# Altium schematic sheet TopSheet.SchDoc
size A4; CompanyName: Technische Hochschule Nürnberg Georg Simon Ohm; Organization: UltraZohm; Address1: Kesslerplatz 12; Address2: 90489 Nürnberg; Address3: GERMANY; DocumentNumber: 1; SheetNumber: 1; SheetTotal: 2; Website: www.ultrazohm.com
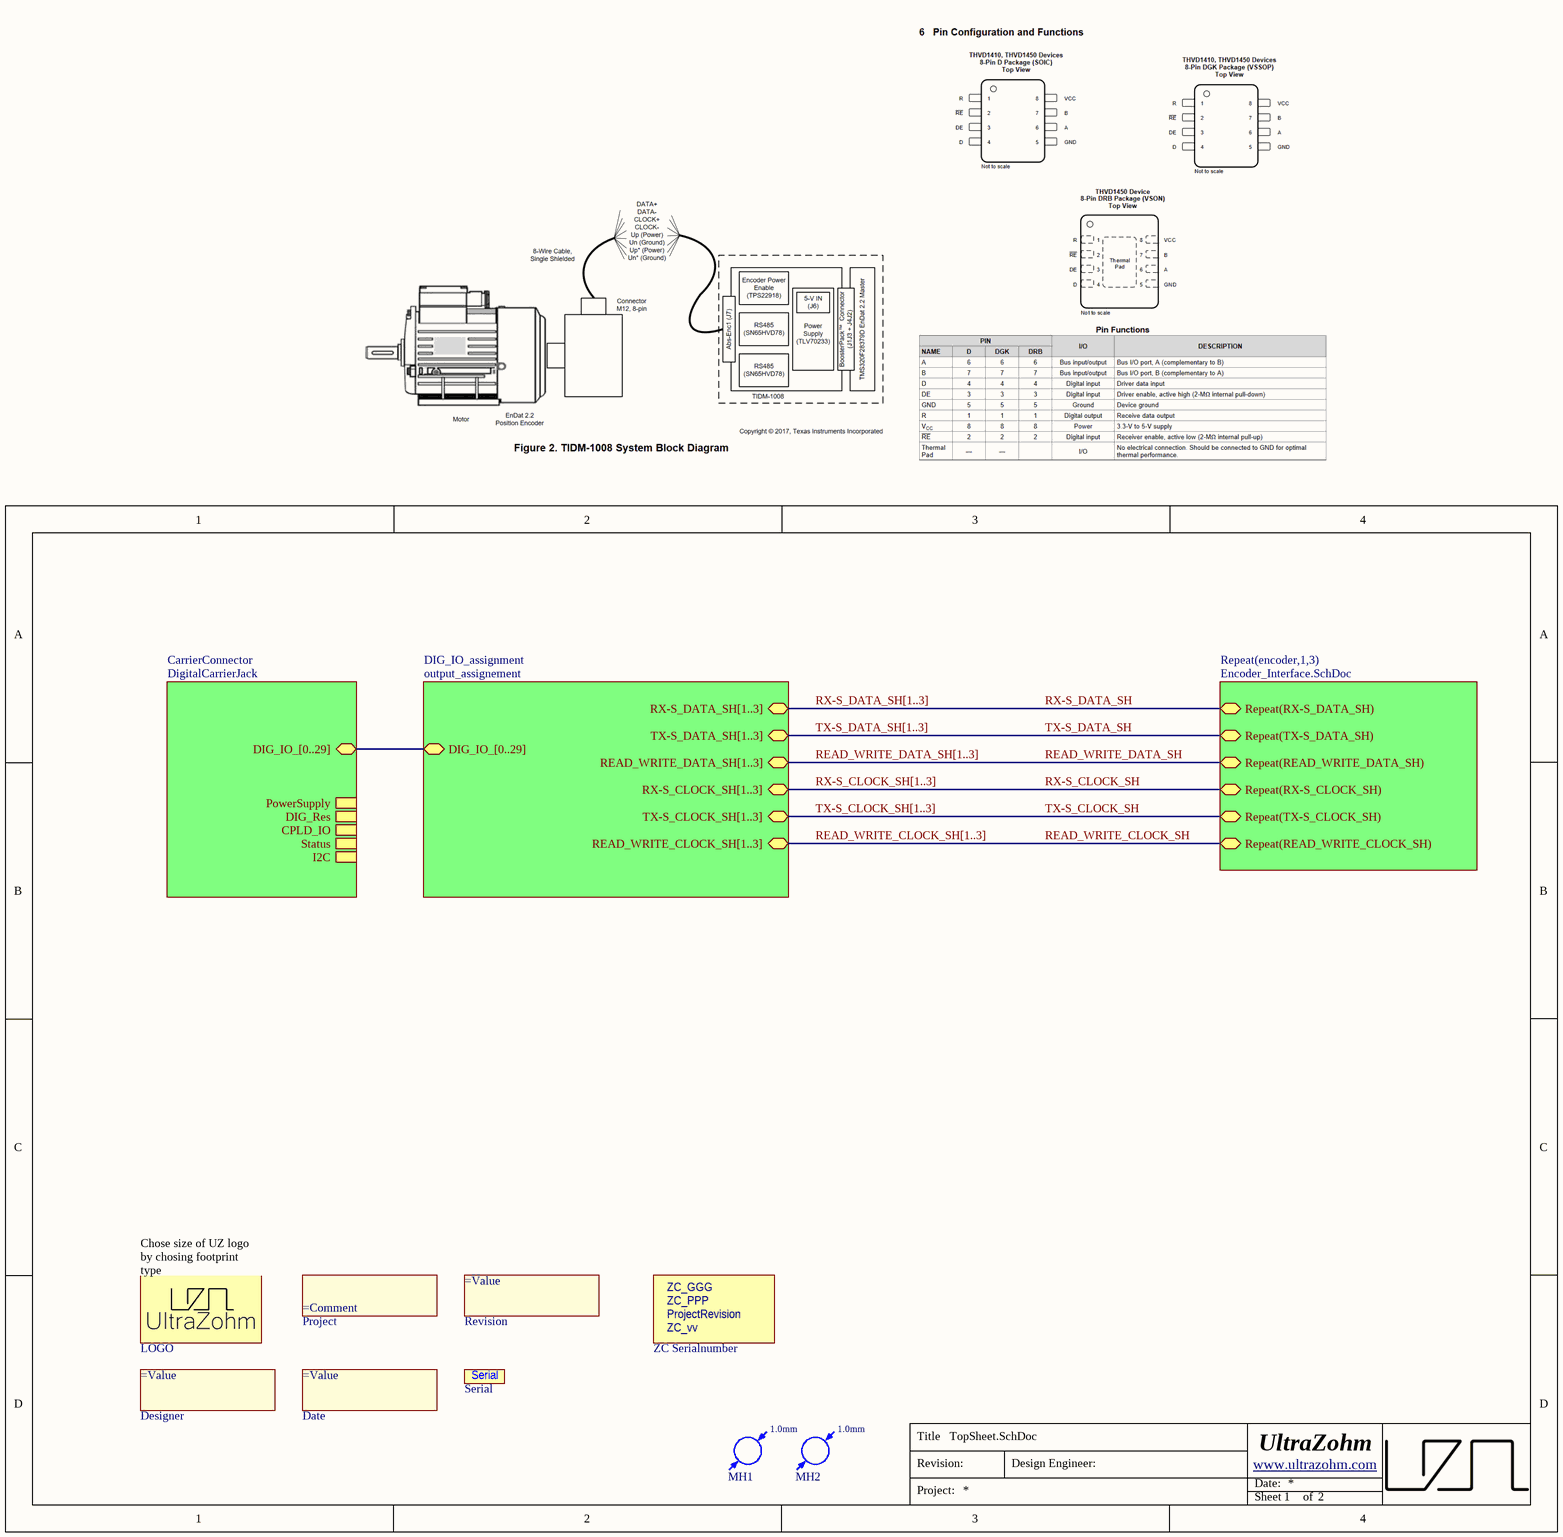
[diagram p0: TopSheet.SchDoc]

## Parts
Date  (no value)  [COMMENT]  (no BOM)
Designer  (no value)  [Designator:comment]  (no BOM)
INFO  ZC Serialnumber  [ZC-Serial]  (no BOM)
LOGO  UZ Logo  [UZ_Logo_small]  (value not drawn)  (no BOM)
MH1  alignment hole 1mm  [MH_1]  (value not drawn)  (no BOM)
MH2  alignment hole 1mm  [MH_1]  (value not drawn)  (no BOM)
Project  (no value)  [COMMENT]  (no BOM)
Revision  (no value)  [Designator:comment]  (no BOM)
Serial  Serial #  [SERIAL]  (value not drawn)  (no BOM)

## Sub-sheets
CarrierConnector = DigitalCarrierJack: PowerSupply (harness DigCon_PowerSupply), DIG_Res (harness DigCon_DIG_Res), CPLD_IO (harness DigCon_DCPLD_IO), Status (harness DigCon_Status), I2C (harness DigCon_I2C), DIG_IO_[0..29] (bidir)
DIG_IO_assignment = output_assignement: TX-S_DATA_SH[1..3] (bidir), READ_WRITE_DATA_SH[1..3] (bidir), RX-S_CLOCK_SH[1..3] (bidir), RX-S_DATA_SH[1..3] (bidir), TX-S_CLOCK_SH[1..3] (bidir), READ_WRITE_CLOCK_SH[1..3] (bidir), DIG_IO_[0..29] (bidir)
Repeat(encoder,1,3) = Encoder_Interface.SchDoc: Repeat(TX-S_DATA_SH) (bidir), Repeat(READ_WRITE_DATA_SH) (bidir), Repeat(RX-S_CLOCK_SH) (bidir), Repeat(RX-S_DATA_SH) (bidir), Repeat(TX-S_CLOCK_SH) (bidir), Repeat(READ_WRITE_CLOCK_SH) (bidir)

## Nets
READ_WRITE_CLOCK_SH: sheet Repeat(encoder,1,3)/Repeat(READ_WRITE_CLOCK_SH)
READ_WRITE_DATA_SH: sheet Repeat(encoder,1,3)/Repeat(READ_WRITE_DATA_SH)
RX-S_CLOCK_SH: sheet Repeat(encoder,1,3)/Repeat(RX-S_CLOCK_SH)
RX-S_DATA_SH: sheet Repeat(encoder,1,3)/Repeat(RX-S_DATA_SH)
TX-S_CLOCK_SH: sheet Repeat(encoder,1,3)/Repeat(TX-S_CLOCK_SH)
TX-S_DATA_SH: sheet Repeat(encoder,1,3)/Repeat(TX-S_DATA_SH)

## Buses and harness runs
bus READ_WRITE_CLOCK_SH[1..3] = sheet DIG_IO_assignment/READ_WRITE_CLOCK_SH[1..3]
bus READ_WRITE_DATA_SH[1..3] = sheet DIG_IO_assignment/READ_WRITE_DATA_SH[1..3]
bus RX-S_CLOCK_SH[1..3] = sheet DIG_IO_assignment/RX-S_CLOCK_SH[1..3]
bus RX-S_DATA_SH[1..3] = sheet DIG_IO_assignment/RX-S_DATA_SH[1..3]
bus sheet CarrierConnector/DIG_IO_[0..29] = sheet DIG_IO_assignment/DIG_IO_[0..29]
bus TX-S_CLOCK_SH[1..3] = sheet DIG_IO_assignment/TX-S_CLOCK_SH[1..3]
bus TX-S_DATA_SH[1..3] = sheet DIG_IO_assignment/TX-S_DATA_SH[1..3]

## Notes on the sheet
- (near LOGO) Chose size of UZ logo by chosing footprint type
- Title
- Revision:
- Design Engineer:
- Date:
- Project:
- Sheet
- of
- (in symbol Mounting Hole - 1mm) 1.0mm
- (in symbol ZC-Serial) ZC_GGG; ZC_PPP; ProjectRevision; ZC_vv

## Library data of the parts
Date = 5: Create a project parameter named "FinDate" this is the value of this component. It is printed on the PCB. Once the parameter is updated (e.g. new revision) it gets updated on the PCB as well; Manufacturer: PCB Manufacturer; Manufacturer Part Number: Project End Date; Created from: T. Wendt; PartID: 5; Created On: 01.03.2021 09:01:41; Component Type: Date of Project Finalization; Last Updated: 01.03.2021 09:01:41; Type: Standard (No BOM); Value: =FinDate; Live Cycle Status: 1
Designer = 4: Create a project parameter named "Author" this is the value of this component. It is printed on the PCB. Once the parameter is updated (e.g. new revision) it gets updated on the PCB as well; Manufacturer: PCB Manufacturer; Manufacturer Part Number: Project Author; Created from: T. Wendt; PartID: 4; Created On: 01.03.2021 08:53:41; Component Type: Project Author; Last Updated: 01.03.2021 09:20:27; Type: Standard (No BOM); Value: =AuthorParam; Live Cycle Status: 1
INFO = ZC-Serial: Manufacturer: UltraZohm; Value: GGG-PPP-VVvv; Created from: FRosner; Manufacturer Part Number: ZC-Serial; PartID: 58; Created On: 15.04.2025 09:17:14; ComponentLink1Description: https://docs.ultrazohm.com/; ComponentLink1URL: homepage; Component Type: ZC Serialnumber; Last Updated: 15.04.2025 09:17:14; Supplier 1: -; Supplier Part Number 1: -; Type: Serial Number; Live Cycle Status: 1
LOGO = 1: Official Project Logo of the UltraZohm; Manufacturer: PCB Manufacturer; Manufacturer Part Number: UltraZohm Logo; Created from: T. Wendt; PartID: 1; Created On: 19.02.2021 16:55:56; ComponentLink1Description: Homepage; ComponentLink1URL: https://ultrazohm.com; Component Type: Logo; Last Updated: 02.03.2021 14:31:24; Type: Standard (No BOM); Live Cycle Status: 1
MH1 MH2 = Mounting Hole - 1mm: Non plated through hole, 1mm
Project = 2: Create a project parameter named "ProjectNameCustom" this is the value of this component and it is printed on the PCB.; Manufacturer: PCB Manufacturer; Created from: T. Wendt; PartID: 2; Created On: 01.03.2021 08:43:57; Component Type: Project Name; Last Updated: 01.03.2021 09:07:27; Manufacturer Part Number: Project Name; Type: Standard (No BOM); Value: =ProjectNameCustom; Live Cycle Status: 1
Revision = 3: Create a project parameter named "ProjectRevision" this is the value of this component. It is printed on the PCB. Once the parameter is updated (e.g. new revision) it gets updated on the PCB as well; Manufacturer: PCB Manufacturer; Created from: T. Wendt; PartID: 3; Created On: 01.03.2021 08:50:34; Component Type: Project Revision; Last Updated: 01.03.2021 09:28:36; Manufacturer Part Number: Project Revision; Type: Standard (No BOM); Value: =ProjectRevision; Live Cycle Status: 1
Serial = 6: Field to put in a serial number; Manufacturer: PCB Manufacturer; Created from: T. Wendt; PartID: 6; Created On: 02.03.2021 14:31:24; Component Type: Serial Number; Last Updated: 02.03.2021 14:31:24; Manufacturer Part Number: Serial Number; Type: Standard (No BOM); Live Cycle Status: 1